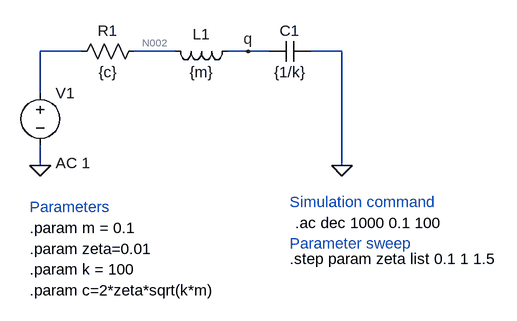
[diagram p0: schematic RLC_2026.asc]
RLC_2026.asc, the LTspice schematic file:
Version 4
SHEET 1 880 680
WIRE 144 80 80 80
WIRE 288 80 224 80
WIRE 400 80 368 80
WIRE 432 80 400 80
WIRE 544 80 496 80
WIRE 80 144 80 80
WIRE 80 256 80 224
WIRE 544 256 544 80
FLAG 80 256 0
FLAG 544 256 0
FLAG 400 80 q
SYMBOL voltage 80 128 R0
WINDOW 123 24 124 Left 2
WINDOW 39 0 0 Left 0
SYMATTR Value2 AC 1
SYMATTR InstName V1
SYMATTR Value ""
SYMBOL res 240 64 R90
WINDOW 0 0 56 VBottom 2
WINDOW 3 32 56 VTop 2
SYMATTR InstName R1
SYMATTR Value {c}
SYMBOL ind 384 64 R90
WINDOW 0 5 56 VBottom 2
WINDOW 3 32 56 VTop 2
SYMATTR InstName L1
SYMATTR Value {m}
SYMBOL cap 496 64 R90
WINDOW 0 0 32 VBottom 2
WINDOW 3 32 32 VTop 2
SYMATTR InstName C1
SYMATTR Value {1/k}
TEXT 64 448 Left 2 !.param c=2*zeta*sqrt(k*m)
TEXT 64 352 Left 2 !.param m = 0.1
TEXT 64 416 Left 2 !.param k = 100
TEXT 64 384 Left 2 !.param zeta=0.01
TEXT 472 344 Left 2 !.ac dec 1000 0.1 100
TEXT 64 320 Left 2 ;Parameters
TEXT 464 312 Left 2 ;Simulation command
TEXT 464 400 Left 2 !.step param zeta list 0.1 1 1.5
TEXT 464 376 Left 2 ;Parameter sweep

The netlist it stands for:
* RLC_2026.asc
V1 N001 0 AC 1
R1 N002 N001 {c}
L1 q N002 {m}
C1 0 q {1/k}
.param c=2*zeta*sqrt(k*m)
.param m = 0.1
.param k = 100
.param zeta=0.01
.ac dec 1000 0.1 100
* Parameters
* Simulation command
.step param zeta list 0.1 1 1.5
* Parameter sweep
.backanno
.end

* Results of the author's LTspice run, read from the files saved beside the schematic
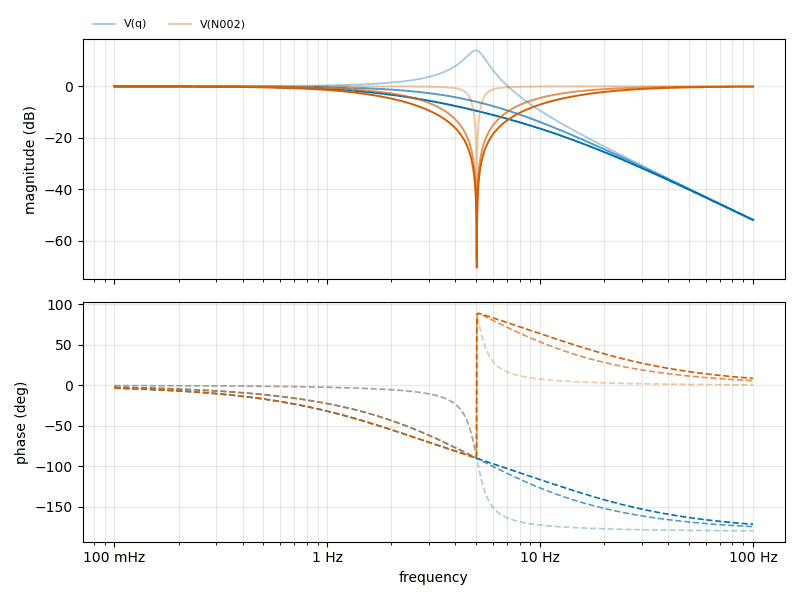
[diagram p1: AC Analysis of RLC_2026.asc, plotted from the saved traces]
* AC Analysis, 3 runs:
*   V(q) [zeta=0.1]: 0.00 dB at 100 mHz, -51.91 dB at 100 Hz, peak 14.01 dB at 4.977 Hz, 3 dB below the peak at 4.447 Hz and 5.465 Hz
*   V(q) [zeta=1]: -0.00 dB at 100 mHz, -51.95 dB at 100 Hz, peak -0.00 dB at 100 mHz, 3 dB below the peak at 3.241 Hz
*   V(q) [zeta=1.5]: -0.01 dB at 100 mHz, -52.00 dB at 100 Hz, peak -0.01 dB at 100 mHz, 3 dB below the peak at 1.888 Hz
*   V(N002) [zeta=0.1]: -0.00 dB at 100 mHz, -0.00 dB at 100 Hz, peak -0.00 dB at 100 mHz, 3 dB below the peak at 4.554 Hz
*   V(N002) [zeta=1]: -0.01 dB at 100 mHz, -0.04 dB at 100 Hz, peak -0.01 dB at 100 mHz, 3 dB below the peak at 2.087 Hz
*   V(N002) [zeta=1.5]: -0.02 dB at 100 mHz, -0.10 dB at 100 Hz, peak -0.02 dB at 100 mHz, 3 dB below the peak at 1.528 Hz